# Altium schematic sheet Flomio BLE-NFC - SoC.SchDoc: Flomio BLE-NFC::Soc
size Tabloid; Author: Alex J. Tucker; CompanyName: Anidea Engineering, Inc.; DrawnBy: Alex J. Tucker; Engineer: Alex J. Tucker; Organization: Anidea Engineering, Inc.; Address1: 8020 Belvedere Rd.; Address2: Ste #1; Address3: West Palm Beach, FL; Address4: 33411    USA; DocumentNumber: 2; Revision: 3; SheetNumber: 2; SheetTotal: 5
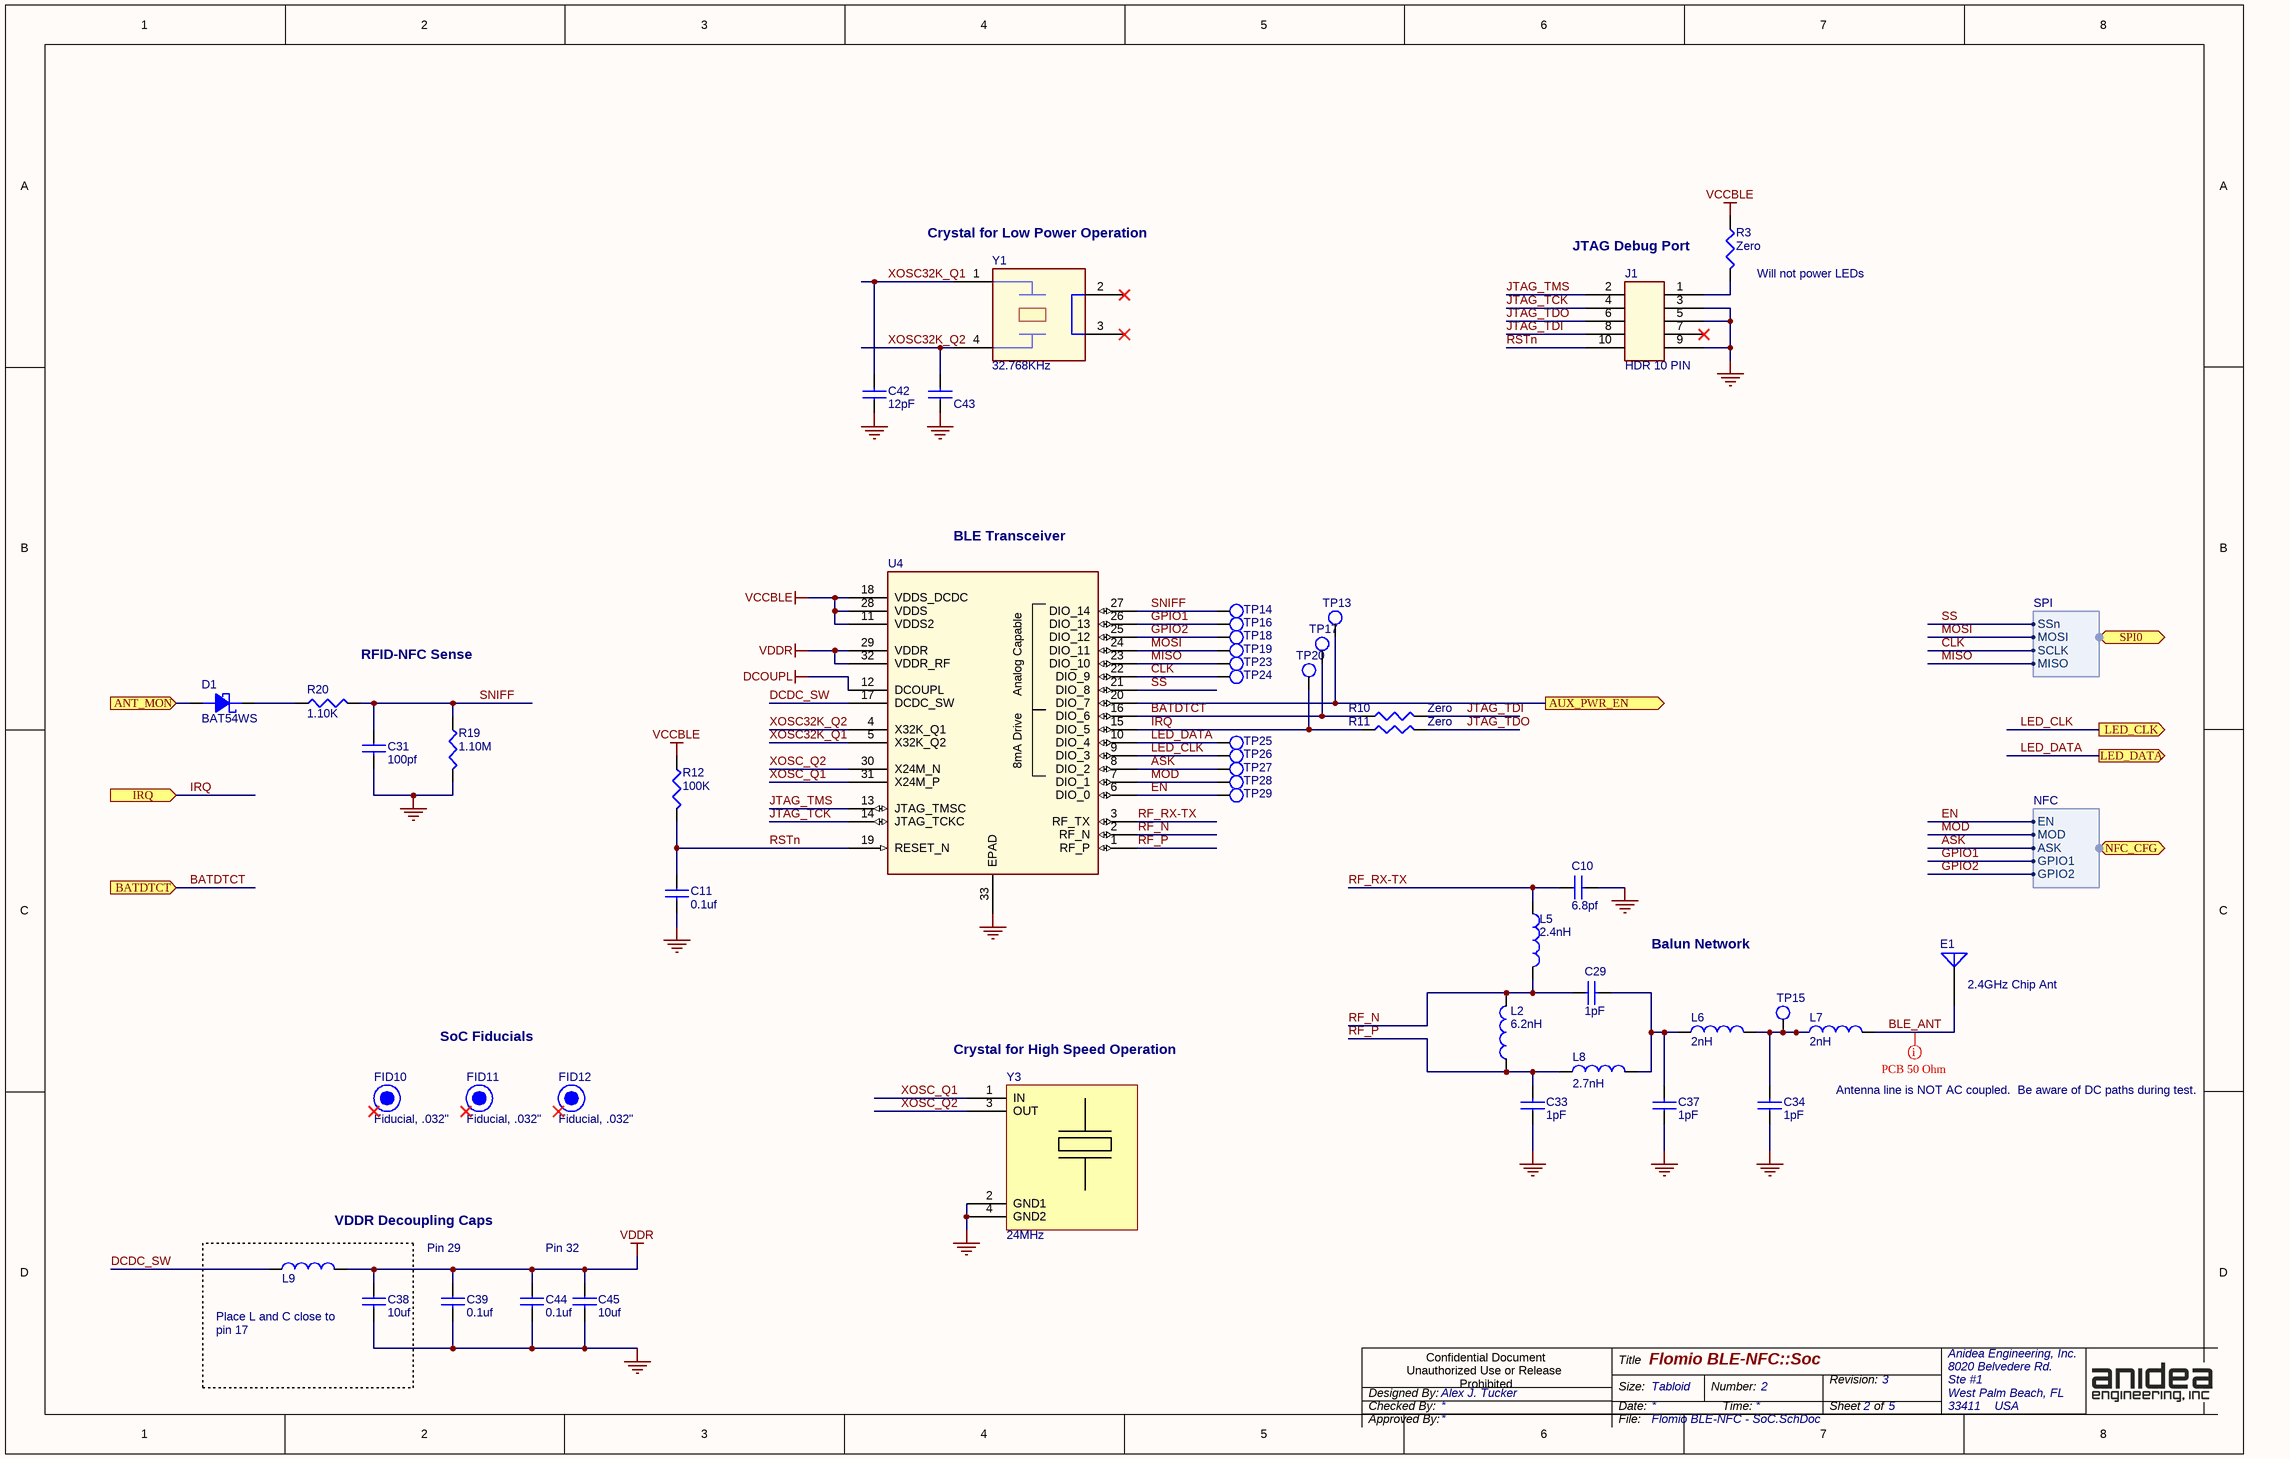
[diagram p0: Flomio BLE-NFC - SoC.SchDoc]

## Parts
C10  6.8pf  [SM/C_0603]
C11  0.1uf  [SM/C_0603]
C29  1pF  [SM/C_0402]
C31  100pf  [SM/C_0603]
C33  1pF  [SM/C_0402]
C34  1pF  [SM/C_0402]
C37  1pF  [SM/C_0402]
C38  10uf  [SM/C_0603]
C39  0.1uf  [SM/C_0603]
C42  12pF  [SM/C_0402]
C43  12pF  [SM/C_0402]  (value not drawn)
C44  0.1uf  [SM/C_0603]
C45  10uf  [SM/C_0603]
D1  BAT54WS  [SOD-323]
E1  2.4GHz Chip Ant  [SM_ANT_Johanson-2450AT43A100E]
FID10  Fiducial, .032"  [FID32]  (no BOM)
FID11  Fiducial, .032"  [FID32]  (no BOM)
FID12  Fiducial, .032"  [FID32]  (no BOM)
J1  HDR 10 PIN  [HDR/SM/2X5/1.27MM]
L2  6.2nH  [SM/I_0402]
L5  2.4nH  [SM/I_0402]
L6  2nH  [SM/I_0402]
L7  2nH  [SM/I_0402]
L8  2.7nH  [SM/I_0402]
L9  10uH  [SM/I_1210]  (value not drawn)
R3  Zero  [SM/R_0402]
R10  Zero  [SM/R_0402]
R11  Zero  [SM/R_0402]
R12  100K  [SM/R_0402]
R19  1.10M  [SM/R_0603]
R20  1.10K  [SM/R_0603]
TP13  TP  [VIA18]  (value not drawn)  (no BOM)
TP14  TP  [VIA18]  (value not drawn)  (no BOM)
TP15  TP  [VIA18]  (value not drawn)  (no BOM)
TP16  TP  [VIA18]  (value not drawn)  (no BOM)
TP17  TP  [VIA18]  (value not drawn)  (no BOM)
TP18  TP  [VIA18]  (value not drawn)  (no BOM)
TP19  TP  [VIA18]  (value not drawn)  (no BOM)
TP20  TP  [VIA18]  (value not drawn)  (no BOM)
TP23  TP  [VIA18]  (value not drawn)  (no BOM)
TP24  TP  [VIA18]  (value not drawn)  (no BOM)
TP25  TP  [VIA18]  (value not drawn)  (no BOM)
TP26  TP  [VIA18]  (value not drawn)  (no BOM)
TP27  TP  [VIA18]  (value not drawn)  (no BOM)
TP28  TP  [VIA18]  (value not drawn)  (no BOM)
TP29  TP  [VIA18]  (value not drawn)  (no BOM)
U4  CC2640_RHB_32  (value not drawn)
Y1  32.768KHz  [CRYSTAL/ABS25]
Y3  24MHz  [CRYSTAL/3.2x2.5mm]

## Blocks framed on the sheet
VDDR Decoupling Caps: C38 L9

## Ports
ANT_MON (in), AUX_PWR_EN (out), BATDTCT (in), IRQ (in), LED_CLK (out), LED_DATA (out), NFC_CFG (harness NFC), SPI0 (harness SPI)

## Harnesses
SPI: SSn, MOSI, SCLK, MISO
NFC: EN, MOD, ASK, GPIO1, GPIO2

## Nets
DCOUPL: U4.12(DCOUPL)
GND: C10.2 C11.2 C31.2 C33.1 C34.1 C37.1 C38.2 C39.2 C42.1 C43.1 C44.2 C45.2 J1.3 J1.5 J1.9 R19.2 U4.33(EPAD) Y3.2(GND1) Y3.4(GND2)
VCCBLE: R3.1 R12.1 U4.11(VDDS2) U4.18(VDDS_DCDC) U4.28(VDDS)
VDDR: C38.1 C39.1 C44.1 C45.1 L9.2 U4.29(VDDR) U4.32(VDDR_RF)
ANT_MON: D1.1(ANODE) ; port ANT_MON
ASK: TP27.1(TP) U4.8(DIO_2) ; port NFC_CFG.ASK
AUX_PWR_EN: TP13.1(TP) U4.20(DIO_7) ; port AUX_PWR_EN
BATDTCT: R10.1 TP17.1(TP) U4.16(DIO_6) ; port BATDTCT
BLE_ANT: E1.1 L7.2
CLK: TP24.1(TP) U4.22(DIO_9) ; port SPI0.SCLK
DCDC_SW: L9.1 U4.17(DCDC_SW)
EN: TP29.1(TP) U4.6(DIO_0) ; port NFC_CFG.EN
GPIO1: TP16.1(TP) U4.26(DIO_13) ; port NFC_CFG.GPIO1
GPIO2: TP18.1(TP) U4.25(DIO_12) ; port NFC_CFG.GPIO2
IRQ: R11.1 TP20.1(TP) U4.15(DIO_5) ; port IRQ
JTAG_TCK: J1.4 U4.14(JTAG_TCKC)
JTAG_TDI: J1.8 R10.2
JTAG_TDO: J1.6 R11.2
JTAG_TMS: J1.2 U4.13(JTAG_TMSC)
LED_CLK: TP26.1(TP) U4.9(DIO_3) ; port LED_CLK
LED_DATA: TP25.1(TP) U4.10(DIO_4) ; port LED_DATA
MISO: TP23.1(TP) U4.23(DIO_10) ; port SPI0.MISO
MOD: TP28.1(TP) U4.7(DIO_1) ; port NFC_CFG.MOD
MOSI: TP19.1(TP) U4.24(DIO_11) ; port SPI0.MOSI
RF_N: C29.1 L2.2 L5.2 U4.2(RF_N)
RF_P: C33.2 L2.1 L8.1 U4.1(RF_P)
RF_RX-TX: C10.1 L5.1 U4.3(RF_TX)
RSTn: C11.1 J1.10 R12.2 U4.19(RESET_N)
SNIFF: C31.1 R19.1 R20.2 TP14.1(TP) U4.27(DIO_14)
SS: U4.21(DIO_8) ; port SPI0.SSn
XOSC32K_Q1: C42.2 U4.5(X32K_Q2) Y1.1
XOSC32K_Q2: C43.2 U4.4(X32K_Q1) Y1.4
XOSC_Q1: U4.31(X24M_P) Y3.1(IN)
XOSC_Q2: U4.30(X24M_N) Y3.3(OUT)
NetC29_2: C29.2 C37.2 L6.1 L8.2
NetC34_2: C34.2 L6.2 L7.1 TP15.1(TP)
NetD1_2: D1.2(CATHODE) R20.1
NetJ1_1: J1.1 R3.2

Not connected (* = marked no-connect by the designer): FID10 1*; FID11 1*; FID12 1*; J1 7*; Y1 2* 3*

## Layout directives
rule Width Constraint [Pref Width = 113mil    Min Width = 113mil    Max Width = 113mil]; rule Clearance Constraint [Clearance = 15mil]: BLE_ANT

## Notes on the sheet
- (near Y1) Crystal for Low Power Operation
- JTAG Debug Port
- (near R3) Will not power LEDs
- BLE Transceiver
- RFID-NFC Sense
- Balun Network
- SoC Fiducials
- (near Y3) Crystal for High Speed Operation
- Antenna line is NOT AC coupled.  Be aware of DC paths during test.
- (near C39) Pin 29
- Pin 32
- Place L and C close to pin 17
- Confidential Document
  Unauthorized Use or Release
  Prohibited
- Checked By:
- Designed By:
- Title
- Size:
- Date:
- Tabloid
- Number:
- Time:
- Revision:
- Sheet
- of
- Approved By:
- File:
- (in symbol CC2640_RHB_32) Analog Capable; 8mA Drive

## Library data of the parts
C10 = GRM1885C1H6R8CZ01: Cap, 0603, 6.8pf, 50V, ±0.25pF; Mfg Part Number: GRM1885C1H6R8CZ01D; Tolerance: 5%; Mfg: Murata; Part Number: GRM1885C1H6R8CZ01; Voltage: 50V; ComponentLink1Description: Local; ComponentLink1URL: \\newbrak\public\pdf\Murata Cap PN.pdf; ComponentLink2Description: Web; Supplier Part Number 1: 490-1395-1-ND; Supplier 1: Digi-Key; RoHS: True
C11 C39 C44 = GRM188R71C104KA01: Cap, 0603, 0.1uf, 16V, 10%, X7R; Mfg Part Number: GRM188R71C104KA01D; Mfg: Murata; Part Number: GRM188R71C104KA01; Rating: X7R; Tolerance: 10%; Voltage: 16V; ComponentLink1Description: Local; ComponentLink1URL: \\brak\public\pdf\Murata Cap PN.pdf; ComponentLink2Description: Web; Supplier Part Number 1: 490-1532-1-ND; Supplier 1: Digi-Key; RoHS: True
C29 C33 C34 C37 = GRM1555C1H1R0CZ01: Cap, 0402, 1pF, 50V, ±0.25pF, C0G, NP0; Mfg Part Number: GRM1555C1H1R0CZ01D; Mfg: Murata; Part Number: GRM1555C1H1R0CZ01; Rating: C0G, NP0; Tolerance: ±0.25pF; Voltage: 50V; ComponentLink1Description: Local; ComponentLink1URL: \\newbrak\public\pdf\Murata Cap PN.pdf; ComponentLink2Description: Web; ComponentLink2URL: http://www.murata.com/products/catalog/pdf/c02e.pdf; Supplier Part Number 1: 490-3199-1-ND; Supplier 1: Digi-Key; Supplier 2: Mouser; Supplier Part Number 2: 81-GRM1555C1H1R0CZ01; RoHS: True
C31 = 06035A101JAT2A: Cap, 0603, 100pf, 50V, 5%, C0G, NP0; Mfg: AVX; Part Number: 06035A101JAT2A; Tolerance: 5%; Voltage: 50V; Mfg Part Number: 06035A101JAT2A; ComponentLink1Description: Local; ComponentLink1URL: \\brak\public\pdf\AVX C0G.pdf; ComponentLink2Description: Web; Supplier Part Number 1: 478-1175-1-ND; Supplier 1: Digi-Key; RoHS: True; Rating: C0G, NP0; ComponentLink2URL: http://www.avx.com/docs/Catalogs/ccog.pdf
C38 C45 = GRM1886ME47: Cap, 0603, 10uf, 6.3V, 20%, X5R; Mfg Part Number: GRM188R60J106ME47D; Mfg: Murata; Part Number: GRM1886ME47; Tolerance: 20%; Voltage: 6.3V; ComponentLink1Description: Local; ComponentLink1URL: \\newbrak\public\pdf\Murata Cap PN.pdf; ComponentLink2Description: Web; Supplier Part Number 1: 490-3896-1-ND; Supplier 1: Digi-Key; RoHS: True
C42 C43 = GRM1555C1H120JZ01: Cap, 0402, 12pF, 50V, 5%, C0G, NP0; Mfg Part Number: GRM1555C1H120JZ01D; Mfg: Murata; Part Number: GRM1555C1H120JZ01; Tolerance: 5%; Voltage: 50V; ComponentLink1Description: Local; ComponentLink1URL: \\newbrak\public\pdf\Murata Cap PN.pdf; ComponentLink2Description: Web; Supplier Part Number 1: 490-1279-1-ND; Supplier 1: Digi-Key; RoHS: True; ComponentLink2URL: http://www.murata.com/products/catalog/pdf/c02e.pdf
D1 = BAT54WS-7-F: Diode, Schottky, 200MA, 30V, SOD323; Rating: 400W; Mfg: Diodes Inc.; Part Number: BAT54WS-7-F; Voltage: 30V; Mfg Part Number: BAT54WS-7-F; ComponentLink1Description: Local; ComponentLink1URL: \\brak\public\pdf\Diodes Inc BAT54WS ds30098.pdf; ComponentLink2Description: Web; ComponentLink2URL: http://www.diodes.com/datasheets/ds30098.pdf; Supplier Part Number 1: BAT54WS-FDICT-ND; Supplier 1: Digi-Key; RoHS: True
E1 = 2450AT43A100E: Antenna, Chip, 2.4GHz, 0.5 dBi Gain, BLE; Mfg: Johanson; Part Number: 2450AT43A100E; Mfg Part Number: 2450AT43A100E; ComponentLink1Description: Local; ComponentLink1URL: \\newbrak\public\pdf\Johanson JTI_Antenna-2450AT43A100_1-04.pdf; ComponentLink2Description: Web; ComponentLink2URL: http://www.johansontechnology.com/images/stories/ip/rf-antennas/JTI_Antenna-2450AT43A100_1-04.pdf; Supplier Part Number 1: 712-1009-1-ND; Supplier 1: Digi-Key; RoHS: True
FID10-FID12 = FID32: Fiducual, .032" Pad; Obsolete: False; Part Number: FID32; ComponentLink1Description: Local; ComponentLink1URL: \\brak\public\pdf\; ComponentLink2Description: Web; RoHS: False; Part Type: Misc\Fiducual
J1 = FTS-105-01-F-DV: Header, Dual Row, 10 pin, 1.27MM, Male, SMT; Mfg: Samtec; Part Number: FTS-105-01-F-DV; Mfg Part Number: FTS-105-01-F-DV; ComponentLink1Description: Local; ComponentLink1URL: \\brak\public\pdf\Samtec FTS Headers.PDF; ComponentLink2Description: Web; ComponentLink2URL: http://www.samtec.com/documents/webfiles/pdf/FTS.PDF; Supplier 1: Samtec; RoHS: True
L2 = LQG15HS6N2S02: Inductor, 0402, 6.2nH, 300mA, ±0.3nH; Mfg Part Number: LQG15HS6N2S02D; Mfg: Murata; Part Number: LQG15HS6N2S02; Rating: 300mA; Tolerance: ±0.3nH; ComponentLink1Description: Local; ComponentLink1URL: \\newbrak\public\pdf\Murata LQG15HS.pdf; ComponentLink2Description: Web; ComponentLink2URL: http://search.murata.co.jp/Ceramy/image/img/PDF/ENG/L0075S0083LQG15HS.pdf; Supplier Part Number 1: 490-2620-1-ND; Supplier 1: Digi-Key; Supplier 2: Mouser; Supplier Part Number 2: 81-LQG15HS6N2S02D; RoHS: True
L5 = LQG15HS2N4S02: Inductor, 0402, 2.4nH, 300mA, ±0.3nH; Mfg Part Number: LQG15HS2N4S02D; Mfg: Murata; Part Number: LQG15HS2N4S02; Rating: 300mA; Tolerance: ±0.3nH; ComponentLink1Description: Local; ComponentLink1URL: \\newbrak\public\pdf\Murata LQG15HS.pdf; ComponentLink2Description: Web; ComponentLink2URL: http://search.murata.co.jp/Ceramy/image/img/PDF/ENG/L0075S0083LQG15HS.pdf; Supplier Part Number 1: 490-8389-1-ND; Supplier 1: Digi-Key; RoHS: True; Supplier 2: Mouser; Supplier Part Number 2: 81-LQG15HS2N4S02D
L6 L7 = LQG15HS2N0S02: Inductor, 0402, 2nH, 300mA, ±0.3nH; Mfg Part Number: LQG15HS2N0S02D; Mfg: Murata; Part Number: LQG15HS2N0S02; Rating: 300mA; Tolerance: ±0.3nH; ComponentLink1Description: Local; ComponentLink1URL: \\newbrak\public\pdf\Murata LQG15HS.pdf; ComponentLink2Description: Web; ComponentLink2URL: http://search.murata.co.jp/Ceramy/image/img/PDF/ENG/L0075S0083LQG15HS.pdf; Supplier Part Number 1: 490-6569-1-ND; Supplier 1: Digi-Key; RoHS: True; Supplier 2: Mouser; Supplier Part Number 2: 81-LQG15HS2N0S02D
L8 = LQG15HS2N7S02: Inductor, 0402, 2.7nH, 300mA, ±0.3nH; Mfg Part Number: LQG15HS2N7S02D; Mfg: Murata; Part Number: LQG15HS2N7S02; Rating: 300mA; Tolerance: ±0.3nH; ComponentLink1Description: Local; ComponentLink1URL: \\newbrak\public\pdf\Murata LQG15HS.pdf; ComponentLink2Description: Web; ComponentLink2URL: http://search.murata.co.jp/Ceramy/image/img/PDF/ENG/L0075S0083LQG15HS.pdf; Supplier Part Number 1: 490-2615-1-ND; Supplier 1: Digi-Key; RoHS: True; Supplier 2: Mouser; Supplier Part Number 2: 81-LQG15HS2N7S02D
L9 = LQH32CN100K23L: Inductor, 1210, 10uH, 300ma; Mfg: Murata; Part Number: LQH32CN100K23L; Rating: 300MA; Mfg Part Number: LQH32CN100K23L; ComponentLink1Description: Local; ComponentLink1URL: \\newbrak\public\pdf\Murata LQH31C, LQH32C, LQH43C Inductors.pdf; ComponentLink2Description: Web; Supplier Part Number 1: 490-2496-1-ND; Supplier 1: Digi-Key; RoHS: True
R3 R10 R11 = CRCW04020000Z0ED: Resistor, 0402, Zero Ohm; Rating: 1/16W; Mfg: Vishay; Part Number: CRCW04020000Z0ED; Tolerance: ZERO; Mfg Part Number: CRCW04020000Z0ED; ComponentLink1Description: Local; ComponentLink1URL: \\newbrak\public\pdf\Vishay CRCW Resistors.pdf; ComponentLink2Description: Web; ComponentLink2URL: http://www.vishay.com/doc?20035; Supplier Part Number 1: 541-0.0JCT-ND; Supplier 1: Digi-Key; Supplier 2: Yageo; Supplier Part Number 2: RC0402JR-070RL; RoHS: True
R12 = CRCW0402100KF: Resistor, 0402, 100K Ohm 1%; Mfg Part Number: CRCW0402100KFKED; Rating: 1/16W; Mfg: Vishay; Part Number: CRCW0402100KF; Tolerance: 1%; ComponentLink1Description: Local; ComponentLink1URL: \\newbrak\public\pdf\Vishay CRCW Resistors.pdf; ComponentLink2Description: Web; ComponentLink2URL: http://www.vishay.com/doc?20035; Supplier Part Number 1: 541-100KLCT-ND; Supplier 1: Digi-Key; RoHS: True
R19 = ERJ-3EKF1104V: Resistor, 0603, 1.10M Ohm 1%; Rating: 1/10W; Mfg: Panasonic; Part Number: ERJ-3EKF1104V; Tolerance: 1%; Mfg Part Number: ERJ-3EKF1104V; ComponentLink1Description: Local; ComponentLink1URL: \\brak\public\pdf\Panasonic AOA0000CE1 Chip Res.pdf; ComponentLink2Description: Web; Supplier Part Number 1: P1.10MHCT-ND; Supplier 1: Digi-Key; RoHS: True; ComponentLink2URL: http://industrial.panasonic.com/www-data/pdf/AOA0000/AOA0000CE1.pdf
R20 = ERJ-3EKF1101V: Resistor, 0603, 1.10K Ohm 1%; Rating: 1/10W; Mfg: Panasonic; Part Number: ERJ-3EKF1101V; Tolerance: 1%; Mfg Part Number: ERJ-3EKF1101V; ComponentLink1Description: Local; ComponentLink1URL: \\brak\public\pdf\Panasonic AOA0000CE1 Chip Res.pdf; ComponentLink2Description: Web; Supplier Part Number 1: P1.10KHCT-ND; Supplier 1: Digi-Key; RoHS: True; ComponentLink2URL: http://industrial.panasonic.com/www-data/pdf/AOA0000/AOA0000CE1.pdf
TP13-TP20 TP23-TP29 = TP18: Testpoint, 18mil Hole, No part, just via; Part Number: TP18; ComponentLink1Description: Local; ComponentLink2Description: Web; RoHS: False
Y1 = ABS25-32.768KHZ-T: Crystal, SMT, 32.768KHz, 12.5pf; Tolerance: ±20ppm; Mfg: Abracon; Part Number: ABS25-32.768KHZ-T; Rating: 12.5pf; Mfg Part Number: ABS25-32.768KHZ-T; ComponentLink1Description: Local; ComponentLink1URL: \\brak\public\pdf\Abracon ABS25 32,768kHz SMD.pdf; ComponentLink2Description: Web; ComponentLink2URL: http://www.abracon.com/Resonators/abs25.pdf; Supplier Part Number 1: 535-9166-1-ND; Supplier 1: Digi-Key; RoHS: True
Y3 = NX3225SA-24.000000MHZ: Crystal, SMT, 24MHz, 8pF, 15ppm; Tolerance: +/- 15ppm; Mfg: NDK; Part Number: NX3225SA-24.000000MHZ; Mfg Part Number: NX3225SA-24.000000MHZ; ComponentLink1Description: Local; ComponentLink1URL: \\newbrak\public\pdf\NDK NX3225SA.pdf; ComponentLink2Description: Web; ComponentLink2URL: http://media.digikey.com/pdf/Data%20Sheets/NDK%20PDFs/NX3225SA.pdf; Supplier Part Number 1: 644-1052-2-ND; Supplier 1: Digi-Key; RoHS: True